# Altium project SkyLight.PrjPcb
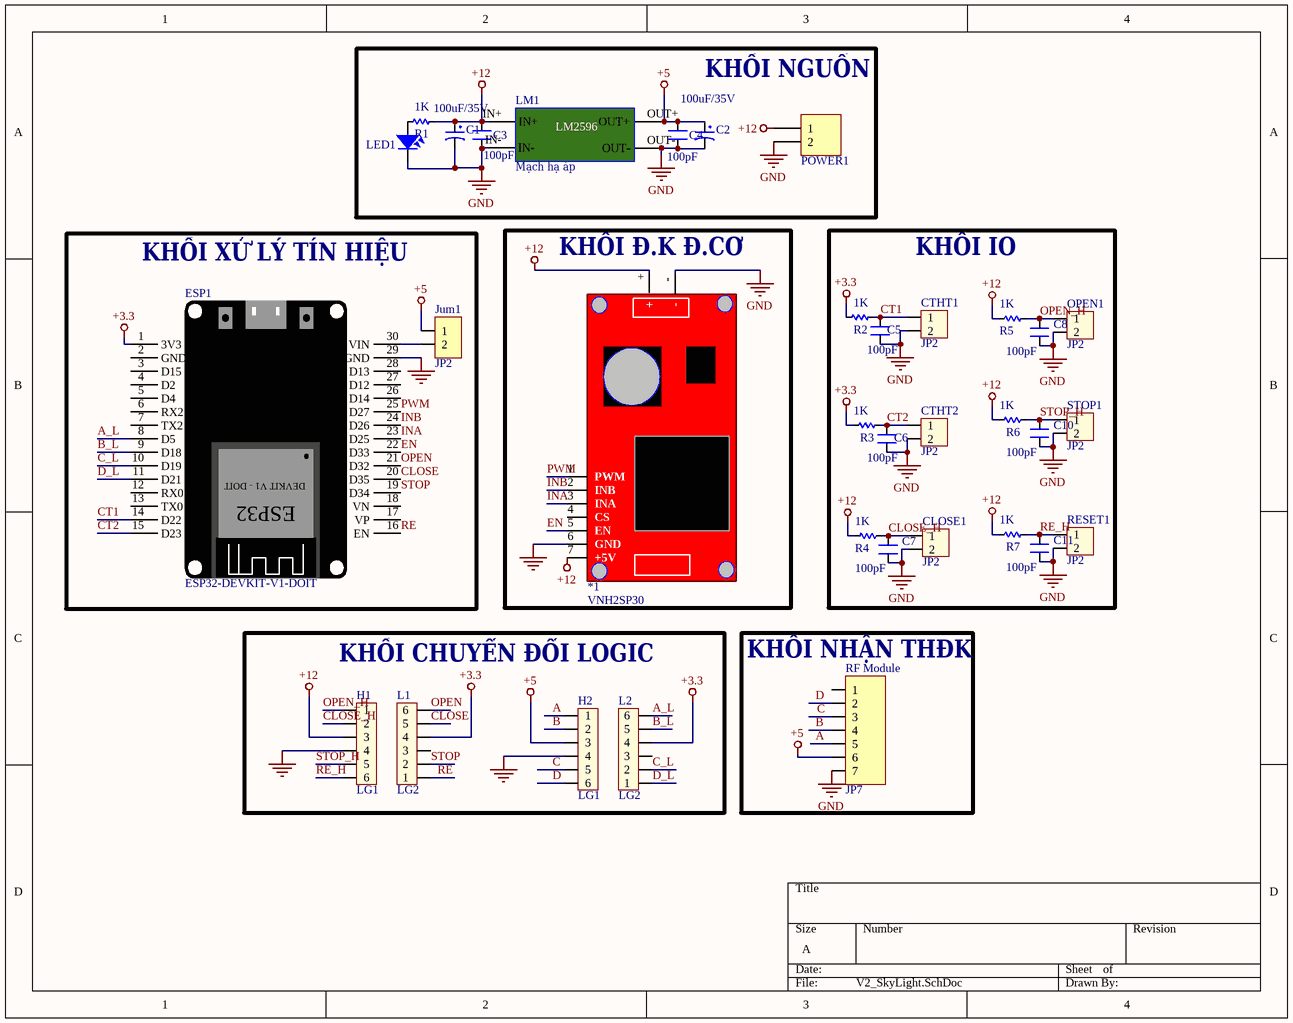
[diagram p0: V2_SkyLight.SchDoc]
1 sheet, 34 parts. Net scope: global (net labels, ports and power ports of the same name join across sheets).
Board files: SkyLight.PcbDoc, V2_SkyLight.PcbDoc

## Sheet V2_SkyLight.SchDoc
size A

### Parts
*1  VNH2SP30  [VNH2SP30]
C1  100uF/35V  [CP1.5/3.4]
C2  100uF/35V  [CP1.5/3.4]
C3  100pF  [CN1]
C4  100pF  [CN1]
C5  100pF  [CN1]
C6  100pF  [CN1]
C7  100pF  [CN1]
C8  100pF  [CN1]
C10  100pF  [CN1]
C11  100pF  [CN1]
CLOSE1  JP2  [CON2]
CTHT1  JP2  [CON2]
CTHT2  JP2  [CON2]
ESP1  ESP32-DEVKIT-V1-DOIT  [ESP32-WROOM-32]
H1  LG1  [JP6]
H2  LG1  [JP6]
Jum1  JP2  [JP2-CLOSED]
L1  LG2  [JP6]
L2  LG2  [JP6]
LED1  LED  [LED-5-RED]  (value not drawn)
LM1  Mạch hạ áp  [LM2596]
OPEN1  JP2  [CON2]
POWER1  Header 2_1  [HED2]  (value not drawn)
R1  1K  [RES-1/4W-SMALL]
R2  1K  [RES-1/4W-SMALL]
R3  1K  [RES-1/4W-SMALL]
R4  1K  [RES-1/4W-SMALL]
R5  1K  [RES-1/4W-SMALL]
R6  1K  [RES-1/4W-SMALL]
R7  1K  [RES-1/4W-SMALL]
RESET1  JP2  [CON2]
RF_Module  JP7  [JP7-C1T]
STOP1  JP2  [CON2]

### Blocks framed on the sheet
KHỐI NGUỒN: C1-C4 LED1 LM1 POWER1 R1
KHỐI XỬ LÝ TÍN HIỆU: ESP1 Jum1
KHỐI Đ.K Đ.CƠ: *1
KHỐI IO: C5-C8 C10 C11 CLOSE1 CTHT1 CTHT2 OPEN1 R2-R7 RESET1 STOP1
KHỐI CHUYỂN ĐỔI LOGIC: H1 H2 L1 L2
KHỐI NHẬN THĐK: RF_Module

### Nets
+3.3: ESP1.1(3V3) L1.4 L2.4 R2.1 R3.1
+5: C2.1 C4.2 H2.3 Jum1.1 LM1.OUT+ RF_Module.6
+12: *1.7(+5V) *1.+ C1.1 C3.2 H1.3 LM1.IN+ POWER1.1 R1.2 R4.1 R5.1 R6.1 R7.1
GND: *1.6(GND) *1.- C1.2 C2.2 C3.1 C4.1 C5.1 C6.1 C7.1 C8.1 C10.1 C11.1 CLOSE1.2 CTHT1.2 CTHT2.2 ESP1.29(GND) H1.4 H2.4 LED1.2 LM1.IN- LM1.OUT- OPEN1.2 POWER1.2 RESET1.2 RF_Module.7 STOP1.2
A: H2.1 RF_Module.5
A_L: ESP1.8(D5) L2.6
B: H2.2 RF_Module.4
B_L: ESP1.9(D18) L2.5
C: H2.5 RF_Module.3
C_L: ESP1.10(D19) L2.2
CLOSE: ESP1.20(D35) L1.5
CLOSE_H: C7.2 CLOSE1.1 H1.2 R4.2
CT1: C5.2 CTHT1.1 ESP1.14(D22) R2.2
CT2: C6.2 CTHT2.1 ESP1.15(D23) R3.2
D: H2.6 RF_Module.2
D_L: ESP1.11(D21) L2.1
EN: *1.5(EN) ESP1.22(D33)
INA: *1.3(INA) ESP1.23(D25)
INB: *1.2(INB) ESP1.24(D26)
OPEN: ESP1.21(D32) L1.6
OPEN_H: C8.2 H1.1 OPEN1.1 R5.2
PWM: *1.1(PWM) ESP1.25(D27)
RE: ESP1.16(EN) L1.1
RE_H: C11.2 H1.6 R7.2 RESET1.1
STOP: ESP1.19(D34) L1.2
STOP_H: C10.2 H1.5 R6.2 STOP1.1
NetESP1_30: ESP1.30(VIN) Jum1.2
NetLED1_1: LED1.1 R1.1

Not connected (* = marked no-connect by the designer): *1 4(CS); ESP1 2(GND) 3(D15) 4(D2) 5(D4) 6(RX2) 7(TX2) 12(RX0) 13(TX0) 17(VP) 18(VN) 26(D14) 27(D12) 28(D13); L1 3; L2 3; RF_Module 1

### Notes on the sheet
- (in symbol ESP32-DEVKIT-V1-DOIT) DEVKIT V1 - DOIT; ESP32

### Library data of the parts
C1 C2 = CP3: Cap 100uF/35V - 470uF/16V; Value: 100uF/35V/50V; Description 1: 1000uF/6,3V - 470uF/16V - 330uF - 25V; Description 2: 220uF/35V - 100uF/50V - 63V - 4,7uF/200V; Description 3: 22uF => 33uF100V - 3,3uF => 4,7uF/250V; Description 4: 2,2uF =>3,3uF/350 - 2,2uF/400V - 1uF/450V
C3-C8 C10 C11 = CN1: Cap np  1pF - 472pF; Value: 100pF
CLOSE1 CTHT1 CTHT2 OPEN1 RESET1 STOP1 = Con2: Connector 2; Value: Connector 2
H1 H2 L1 L2 = JP6: JP6 PIN; Value: JP7
Jum1 = JP2: WR-PHD 2.54 mm Angled Socket Header; Manufacturer: W¨¹rth Elektronik eiSos GmbH; partNo: 613002143121; ComponentLink1 Description: Manufacturer; ComponentLink2 Description: Datasheet; NoPins: 02; Created Date: 29 March 2013; ComponentLink1URL: http://www.we-online.com; ComponentLink2URL: http://katalog.we-online.de/em/datasheet/6130xx143121.pdf; Created by: Karrer Zheng
LED1 = LED: LED Single colour Green and Red; Value: LED 3 ly Single Colour
LM1 = LM2596
POWER1 = Header 2_1: Header, 2-Pin; Manufacturer: Generic Components; Class: Connector; Value: Header 2
R1-R7 = Res: Manufacturer: Generic Components; Class: Passive; SubClass: R; Published: 08/06/2000; Publisher: Altium Hobart Technology Centre
RF_Module = JP7: WR-PHD 2.54 mm Angled Socket Header; Manufacturer: W¨¹rth Elektronik eiSos GmbH; partNo: 613007143121; ComponentLink1 Description: Manufacturer; ComponentLink2 Description: Datasheet; NoPins: 07; Created Date: 29 March 2013; ComponentLink1URL: http://www.we-online.com; ComponentLink2URL: http://katalog.we-online.de/em/datasheet/6130xx143121.pdf; Created by: Karrer Zheng